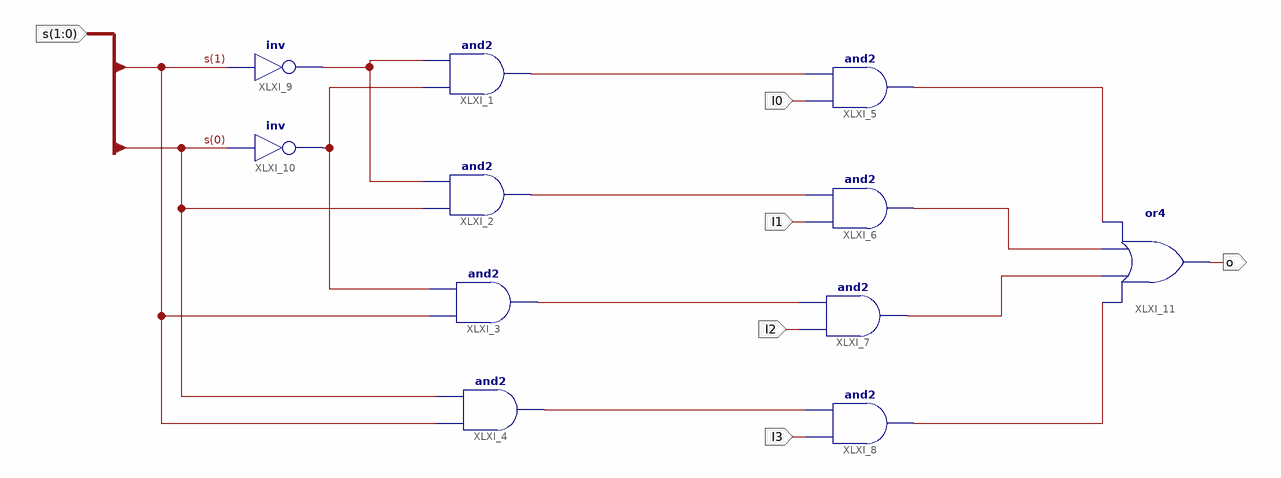
[diagram p0: schematic sheet 1]
// Xilinx ISE schematic Mux4to1.sch (spartan3) as structural Verilog: 11 symbols, 6 ports
module Mux4to1 (
  input  [1:0] s,
  input  I0,
  input  I1,
  input  I2,
  input  I3,
  output o
);

  wire XLXN_17, XLXN_20, XLXN_26, XLXN_27, XLXN_28, XLXN_29, XLXN_30, XLXN_31, XLXN_32, XLXN_33;

  and XLXI_1 (XLXN_26, XLXN_20, XLXN_17);
  and XLXI_2 (XLXN_27, s[0], XLXN_17);
  and XLXI_3 (XLXN_28, s[1], XLXN_20);
  and XLXI_4 (XLXN_29, s[1], s[0]);
  and XLXI_5 (XLXN_30, I0, XLXN_26);
  and XLXI_6 (XLXN_31, I1, XLXN_27);
  and XLXI_7 (XLXN_32, I2, XLXN_28);
  and XLXI_8 (XLXN_33, I3, XLXN_29);
  or XLXI_11 (o, XLXN_33, XLXN_32, XLXN_31, XLXN_30);
  not XLXI_10 (XLXN_20, s[0]);
  not XLXI_9 (XLXN_17, s[1]);
endmodule
